# Altium schematic sheet Modulo_de_apertura_RS485.SchDoc: Modulo de apertura RS485
size A4; Author: Agustin Dubuisson; SheetNumber: 2; SheetTotal: 4
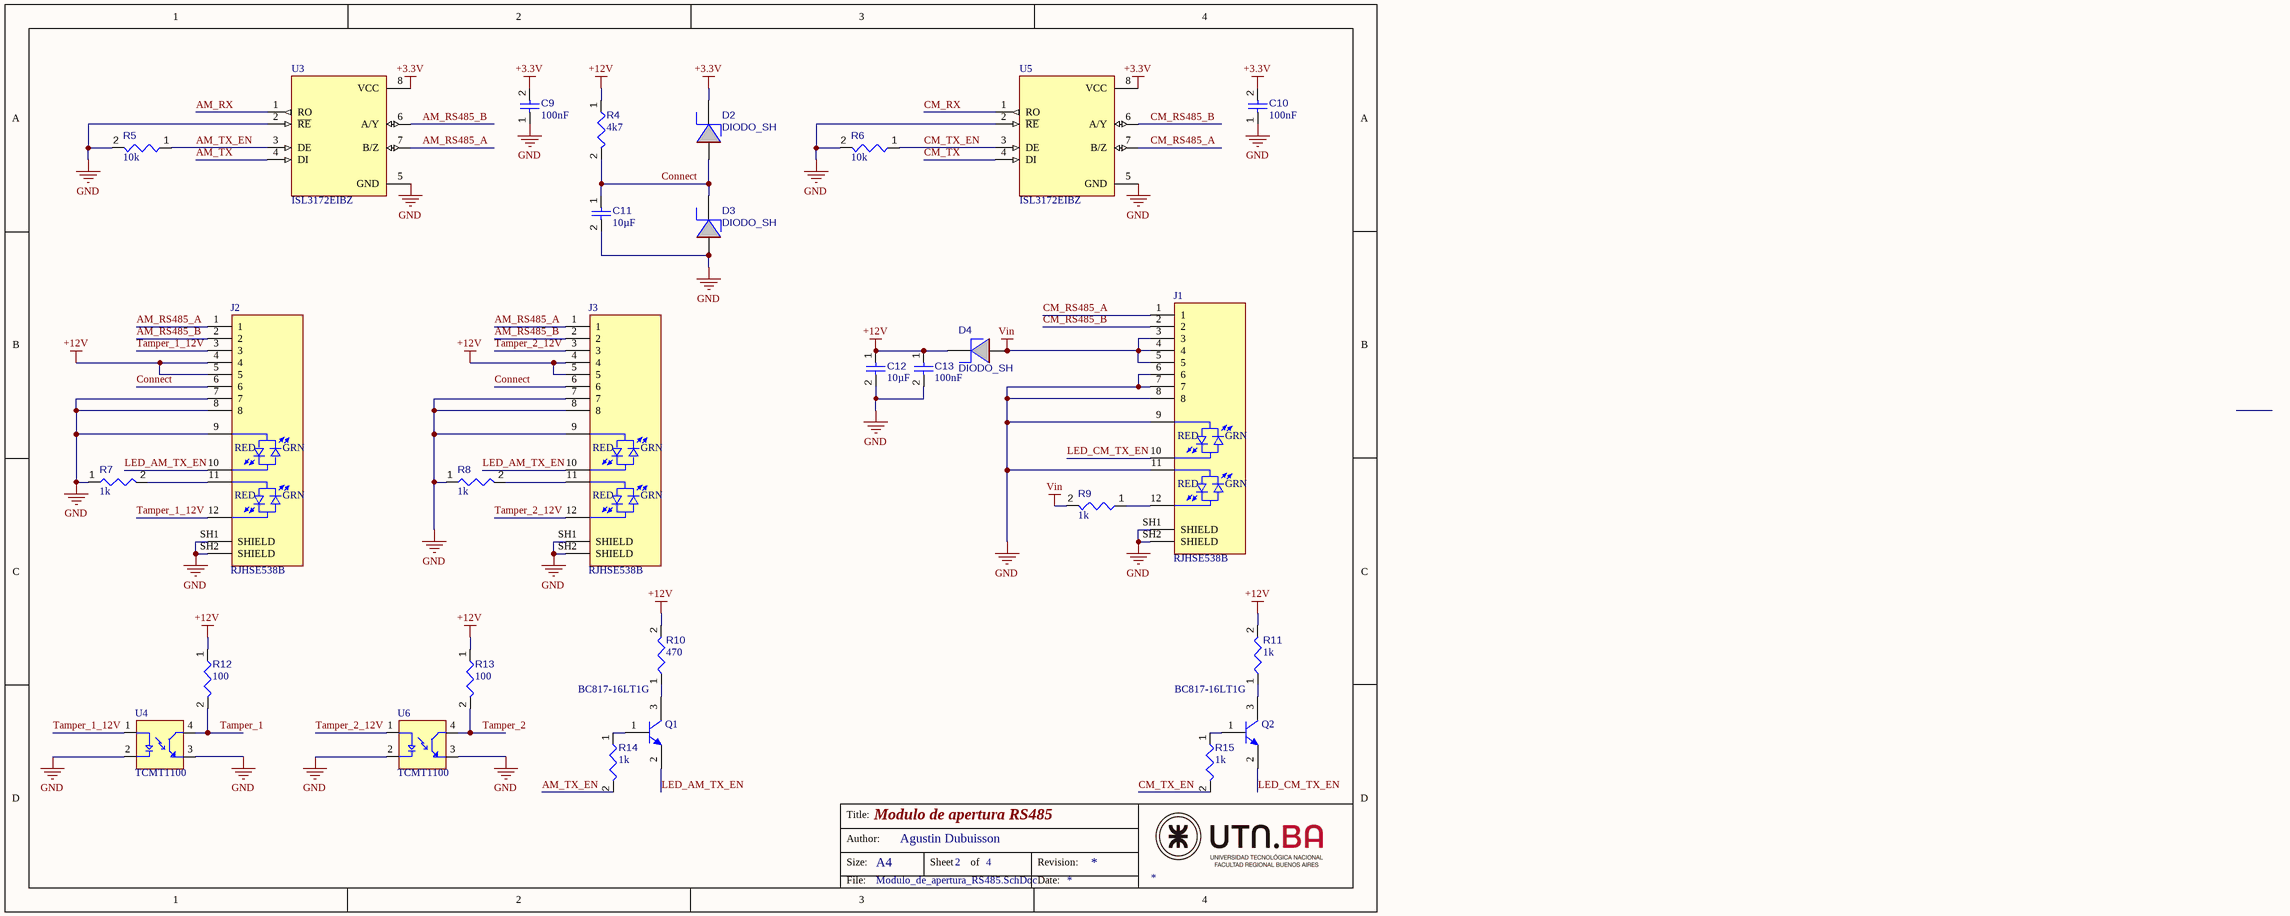
[diagram p0: Modulo_de_apertura_RS485.SchDoc]

## Parts
C9  value 100nF  [CAPC0402(1005)60_L]  (hidden comment: Capacitor 100nF +/-20% 10V 0402)
C10  value 100nF  [CAPC0402(1005)60_L]  (hidden comment: Capacitor 100nF +/-20% 10V 0402)
C11  value 10µF  [CAPC0603(1608)100_L]  (hidden comment: Capacitor 10µF +/-20% 10V 0603)
C12  value 10µF  [CAPC0603(1608)100_L]  (hidden comment: Capacitor 10µF +/-20% 10V 0603)
C13  value 100nF  [CAPC0402(1005)60_L]  (hidden comment: Capacitor 100nF +/-20% 10V 0402)
D2  DIODO_SH  [D_SMA]
D3  DIODO_SH  [D_SMA]
D4  DIODO_SH  [D_SMA]
J1  RJHSE538B  [AMPHENOL_RJHSE538B]
J2  RJHSE538B  [AMPHENOL_RJHSE538B]
J3  RJHSE538B  [AMPHENOL_RJHSE538B]
Q1  BC817-16LT1G  [ONSC-SOT-23-3-318-08_V]
Q2  BC817-16LT1G  [ONSC-SOT-23-3-318-08_V]
R4  value 4k7  [RESC0402(1005)_L]  (hidden comment: Resistor 10K  +/-1 % 0402 63 mW)
R5  value 10k  [RESC0402(1005)_L]  (hidden comment: Resistor 10K  +/-1 % 0402 63 mW)
R6  value 10k  [RESC0402(1005)_L]  (hidden comment: Resistor 10K  +/-1 % 0402 63 mW)
R7  value 1k  [RESC0402(1005)_L]  (hidden comment: Resistor 10K  +/-1 % 0402 63 mW)
R8  value 1k  [RESC0402(1005)_L]  (hidden comment: Resistor 10K  +/-1 % 0402 63 mW)
R9  value 1k  [RESC0402(1005)_L]  (hidden comment: Resistor 10K  +/-1 % 0402 63 mW)
R10  value 470  [RESC0402(1005)_L]  (hidden comment: Resistor 10K  +/-1 % 0402 63 mW)
R11  value 1k  [RESC0402(1005)_L]  (hidden comment: Resistor 10K  +/-1 % 0402 63 mW)
R12  value 100  [RESC0402(1005)_L]  (hidden comment: Resistor 10K  +/-1 % 0402 63 mW)
R13  value 100  [RESC0402(1005)_L]  (hidden comment: Resistor 10K  +/-1 % 0402 63 mW)
R14  value 1k  [RESC0402(1005)_L]  (hidden comment: Resistor 10K  +/-1 % 0402 63 mW)
R15  value 1k  [RESC0402(1005)_L]  (hidden comment: Resistor 10K  +/-1 % 0402 63 mW)
U3  ISL3172EIBZ  [SOIC127P600X175-8N]
U4  TCMT1100  [SOIC127P700X230-4N]
U5  ISL3172EIBZ  [SOIC127P600X175-8N]
U6  TCMT1100  [SOIC127P700X230-4N]

## Nets
+3.3V: C9.2 C10.2 D2.2(K) U3.8(VCC) U5.8(VCC)
+12V: C12.1 C13.1 D4.2(K) J2.4 J2.5 J3.4 J3.5 R4.1 R10.2 R11.2 R12.1 R13.1
GND: C9.1 C10.1 C11.2 C12.2 C13.2 D3.1(A) J1.6 J1.7 J1.8 J1.9 J1.11 J1.SH1(SHIELD) J1.SH2(SHIELD) J2.7 J2.8 J2.9 J2.SH1(SHIELD) J2.SH2(SHIELD) J3.7 J3.8 J3.9 J3.SH1(SHIELD) J3.SH2(SHIELD) R5.2 R6.2 R7.1 R8.1 U3.2(~{RE}) U3.5(GND) U4.2(C) U4.3(ET) U5.2(~{RE}) U5.5(GND) U6.2(C) U6.3(ET)
Vin: D4.1(A) J1.3 J1.4 J1.5 R9.2
AM_RS485_A: J2.1 J3.1 U3.7(B/Z)
AM_RS485_B: J2.2 J3.2 U3.6(A/Y)
AM_RX: U3.1(RO)
AM_TX: U3.4(DI)
AM_TX_EN: R5.1 R14.2 U3.3(DE)
CM_RS485_A: J1.1 U5.7(B/Z)
CM_RS485_B: J1.2 U5.6(A/Y)
CM_RX: U5.1(RO)
CM_TX: U5.4(DI)
CM_TX_EN: R6.1 R15.2 U5.3(DE)
Connect: C11.1 D2.1(A) D3.2(K) J2.6 J3.6 R4.2
LED_AM_TX_EN: J2.10 J3.10 Q1.2(E)
LED_CM_TX_EN: J1.10 Q2.2(E)
Tamper_1: R12.2 U4.4(CT)
Tamper_1_12V: J2.3 J2.12 U4.1(A)
Tamper_2: R13.2 U6.4(CT)
Tamper_2_12V: J3.3 J3.12 U6.1(A)
NetJ1_12: J1.12 R9.1
NetJ2_11: J2.11 R7.2
NetJ3_11: J3.11 R8.2
NetQ1_1: Q1.1(B) R14.1
NetQ1_3: Q1.3(C) R10.1
NetQ2_1: Q2.1(B) R15.1
NetQ2_3: Q2.3(C) R11.1

## Notes on the sheet
- Title:
- Size:
- Author:
- A4
- Sheet
- of
- Revision:
- File:
- Date:
- (in symbol RJHSE538B) RED; GRN

## Library data of the parts
C9 C10 C13 = CMP-001-00061-3: Chip Capacitor, 100nF +/-20%, 10V, 0402, Thickness 0.6 mm; Tolerance: 20%; Mounting Technology: SMT; Voltage Rating: 10V; Max Operating Temperature: 85°C; Pins: 2; Case/Package: 0402; Min Operating Temperature: -55°C
C11 C12 = CMP-001-00075-4: Chip Capacitor, 10µF +/-20%, 10V, 0603, Thickness 1 mm; Tolerance: 10%; Voltage Rating: 10V; Max Operating Temperature: 85°C; Pins: 2; Case/Package: 0603; Mounting Technology: SMT; Min Operating Temperature: -55°C
D2-D4 = DIODO_SH: Diode Shottky
J1-J3 = RJHSE538B: MF: {'manufacturer': u'Amphenol ICC (Commercial Products)'}; Package: None; Price: None; Value: *; MP: RJHSE538B; Availability: Unavailable
Q1 Q2 = CMP-1048-00736-1: General Purpose Transistor, NPN Silicon, 3-Pin SOT-23, Pb-Free, Tape and Reel; Manufacturer: On Semiconductor; IC Continuous (A): 0.5; fT Min (MHz): 100; PartNumber: BC817-16LT1G; Mounting Technology: Surface Mount; PackageVersion: Rev. AP, 11/2009; ComponentLink3Description: Package Specification; PackageReference: SOT-23-3-318-08; Packing: Tape and Reel; ComponentLink1URL: http://www.onsemi.com/; Polarity: NPN; RoHS: TRUE; ComponentLink2URL: http://www.onsemi.com/pub_link/Collateral/BC817-16LT1-D.PDF; ComponentLink3URL: http://www.onsemi.cn/pub_link/Collateral/318-08.PDF; ComponentLink2Description: Datasheet; PackageDescription: 3-Pin Small Outline Transistor, Body 2.92 x 1.3 mm, Pitch 0.95 mm; ComponentLink1Description: Manufacturer URL; DatasheetVersion: Rev. 12
R4-R15 = CMP-009-00149-3: Chip Resistor, 10 kOhms, +/-1 %, 63 mW, -55 to 125 degC, 0402; Power: 63mW; Tolerance: 1%; Min Operating Temperature: -55°C; Case/Package: 0402; Max Operating Temperature: 155°C; Pins: 2
U3 U5 = ISL3172EIBZ: 1/1 Transceiver Half RS422, RS485 8-SOIC; MF: Renesas Electronics America Inc; SnapEDA_Link: https://www.snapeda.com/parts/ISL3172EIBZ/Renesas/view-part/?ref=snap; Package: SOIC-8 Renesas; Value: *; MP: ISL3172EIBZ; Check_prices: https://www.snapeda.com/parts/ISL3172EIBZ/Renesas/view-part/?ref=eda
U4 U6 = TCMT1100: Optoisolator Transistor Output 3750Vrms 1 Channel 4-SOP; MF: Vishay Semiconductor; SnapEDA_Link: https://www.snapeda.com/parts/TCMT1100/Vishay/view-part/?ref=snap; Package: SOP-4 Vishay Semiconductor; Value: *; MP: TCMT1100; Check_prices: https://www.snapeda.com/parts/TCMT1100/Vishay/view-part/?ref=eda